# Altium project First_Altium_PCB.PrjPcb
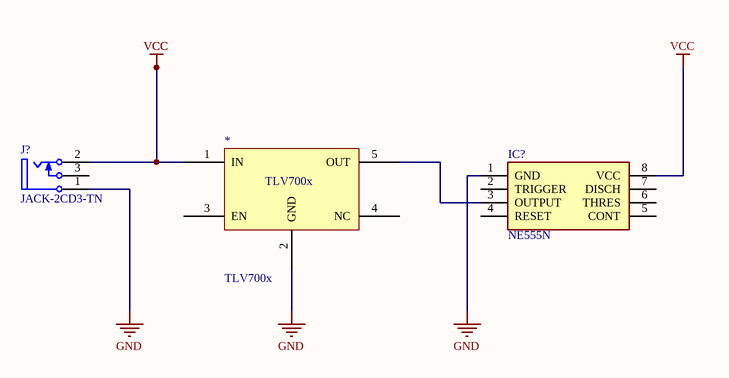
[diagram p0: Master.SchDoc]
1 sheet, 3 parts. Net scope: global (net labels, ports and power ports of the same name join across sheets).

## Sheet Master.SchDoc
size A4; SheetNumber: 1; SheetTotal: 1

### Parts
*  TLV700x  [SOT-23-THIN]
IC?  NE555N  [DIP762W56P254L959H533Q8N]
J?  JACK-2CD3-TN  [SWIT-RASM722X_V]

### Nets
GND: *.2(GND) IC?.1(GND) J?.1(SLEEVE)
VCC: *.1(IN) IC?.8(VCC) J?.2(TIP)
Net*_5: *.5(OUT) IC?.3(OUTPUT)

Not connected (* = marked no-connect by the designer): * 3(EN) 4(NC); IC? 2(TRIGGER) 4(RESET) 5(CONT) 6(THRES) 7(DISCH); J? 3(SHUNT)

### Library data of the parts
IC? = NE555N: Integrated Circuit; Manufacturer_Name: HGSEMI; Datasheet Link: https://datasheet.lcsc.com/szlcsc/1906111919_HGSEMI-NE555N_C398063.pdf; Height: 5.33mm; Manufacturer_Part_Number: NE555N